# Altium project front_controller.PrjPcb
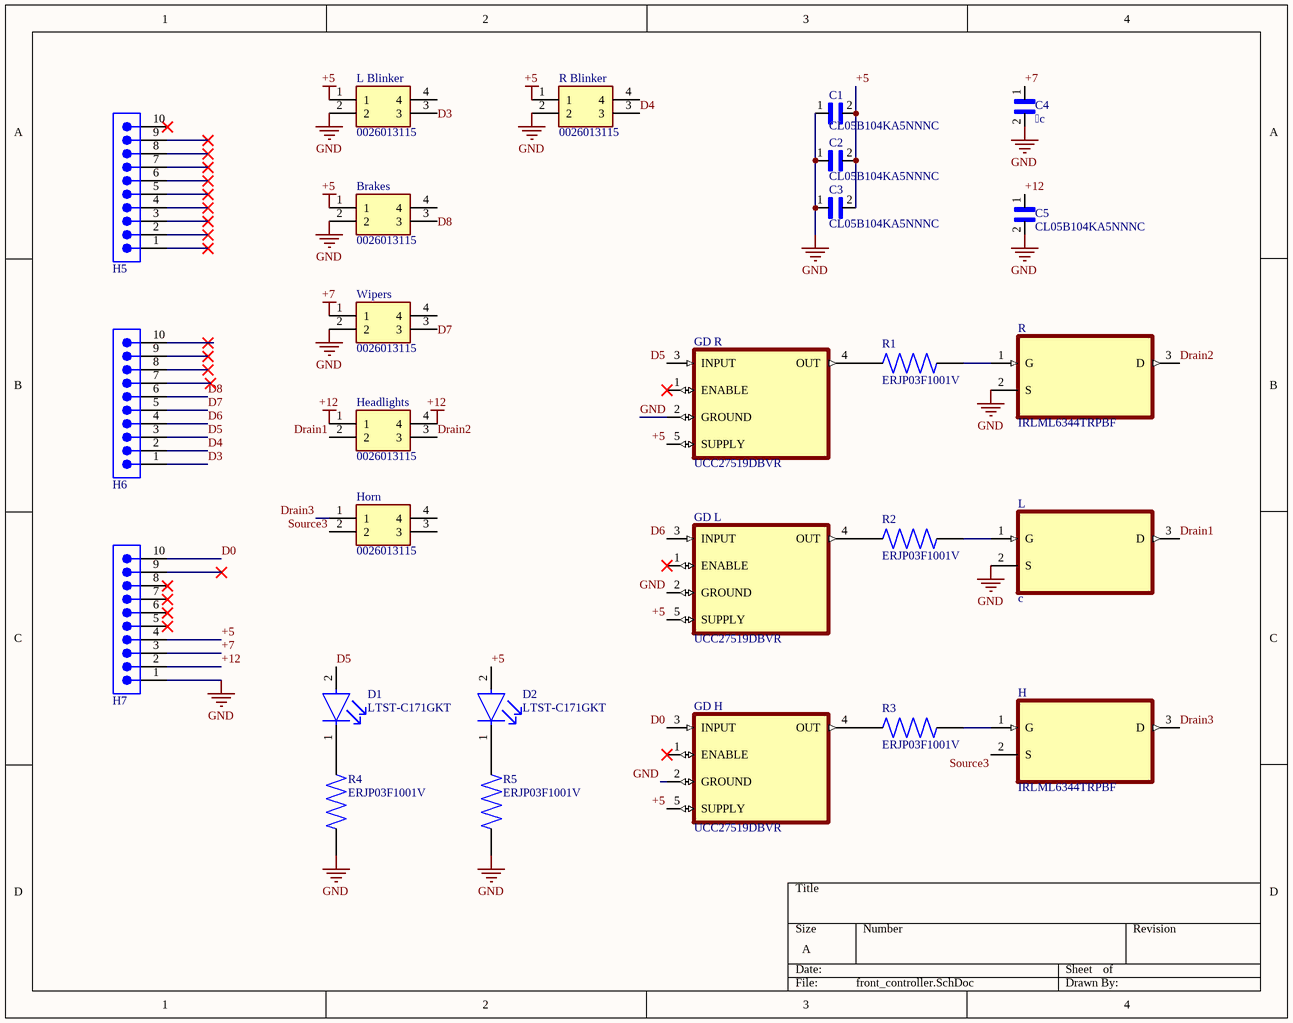
[diagram p0: front_controller.SchDoc]
1 sheet, 27 parts. Net scope: global (net labels, ports and power ports of the same name join across sheets).
Board files: front_controller.PcbDoc, front_controller - Copy.PcbDoc

## Sheet front_controller.SchDoc
size A; SheetNumber: 1; SheetTotal: 1

### Parts
Brakes  0026013115  [MOLEX_0026013115]
C1  CL05B104KA5NNNC  [CAPC1005X55N]
C2  CL05B104KA5NNNC  [CAPC1005X55N]
C3  CL05B104KA5NNNC  [CAPC1005X55N]
C4  c  [CAPC1005X55N]
C5  CL05B104KA5NNNC  [CAPC1005X55N]
D1  LTST-C171GKT  [FP-LTST-C171GKT-MFG]
D2  LTST-C171GKT  [FP-LTST-C171GKT-MFG]
GD_H  UCC27519DBVR  [SOT95P280X145-5N]
GD_L  UCC27519DBVR  [SOT95P280X145-5N]
GD_R  UCC27519DBVR  [SOT95P280X145-5N]
H  IRLML6344TRPBF  [SOT95P240X112-3N]
H5  61301011121  [61301011121]  (value not drawn)
H6  61301011121  [61301011121]  (value not drawn)
H7  61301011121  [61301011121]  (value not drawn)
Headlights  0026013115  [MOLEX_0026013115]
Horn  0026013115  [MOLEX_0026013115]
L  c  [SOT95P240X112-3N]
L_Blinker  0026013115  [MOLEX_0026013115]
R  IRLML6344TRPBF  [SOT95P240X112-3N]
R1  ERJP03F1001V  [RES_ERJP03F1001V]
R2  ERJP03F1001V  [RES_ERJP03F1001V]
R3  ERJP03F1001V  [RES_ERJP03F1001V]
R4  ERJP03F1001V  [RES_ERJP03F1001V]
R5  ERJP03F1001V  [RES_ERJP03F1001V]
R_Blinker  0026013115  [MOLEX_0026013115]
Wipers  0026013115  [MOLEX_0026013115]

### Nets
+5: Brakes.1 C1.2 C2.2 C3.2 D2.2(A) GD_H.5(SUPPLY) GD_L.5(SUPPLY) GD_R.5(SUPPLY) H7.4 L_Blinker.1 R_Blinker.1
+7: C4.1 H7.3 Wipers.1
+12: C5.1 H7.2 Headlights.1 Headlights.4
GND: Brakes.2 C1.1 C2.1 C3.1 C4.2 C5.2 GD_H.2(GROUND) GD_L.2(GROUND) GD_R.2(GROUND) H7.1 L.2(S) L_Blinker.2 R.2(S) R4.1 R5.1 R_Blinker.2 Wipers.2
D0: GD_H.3(INPUT) H7.10
D3: H6.1 L_Blinker.3
D4: H6.2 R_Blinker.3
D5: D1.2(A) GD_R.3(INPUT) H6.3
D6: GD_L.3(INPUT) H6.4
D7: H6.5 Wipers.3
D8: Brakes.3 H6.6
Drain1: Headlights.2 L.3(D)
Drain2: Headlights.3 R.3(D)
Drain3: H.3(D) Horn.1
Source3: H.2(S) Horn.2
NetD1_1: D1.1(C) R4.2
NetD2_1: D2.1(C) R5.2
NetGD_H_4: GD_H.4(OUT) R3.1
NetGD_L_4: GD_L.4(OUT) R2.1
NetGD_R_4: GD_R.4(OUT) R1.1
NetH_1: H.1(G) R3.2
NetL_1: L.1(G) R2.2
NetR_1: R.1(G) R1.2

Not connected (* = marked no-connect by the designer): Brakes 4; GD_H 1(ENABLE)*; GD_L 1(ENABLE)*; GD_R 1(ENABLE)*; H5 1* 2* 3* 4* 5* 6* 7* 8* 9* 10*; H6 7* 8* 9* 10*; H7 5* 6* 7* 8* 9*; Horn 3 4; L_Blinker 4; R_Blinker 4; Wipers 4

### Library data of the parts
Brakes Headlights Horn L_Blinker R_Blinker Wipers = 0026013115: Connector Header Through Hole, Right Angle 4 position 0.165 (4.20mm); MF: Molex; Package: None; MP: 0026013115; DigiKey-Purchase-URL: https://snapeda.com/shop?store=DigiKey&id=2597941; Value: *; SnapEDA_Link: https://www.snapeda.com/parts/0026013115/Molex/view-part/2597941/?ref=snap; Price: None; Availability: Unavailable
C1-C5 = CL05B104KA5NNNC: 0.1ÂµF Â±10% 25V Ceramic Capacitor X7R 0402 (1005 Metric); MF: Samsung Electro-Mechanics; SnapEDA_Link: https://www.snapeda.com/parts/CL05B104KA5NNNC/Samsung%20Electro-Mechanics/view-part/1365388/?ref=snap; MP: CL05B104KA5NNNC; DigiKey-Purchase-URL: https://snapeda.com/shop?store=DigiKey&id=1365388; Value: *; Digi-Key_Part_Number: 1276-6720-1-ND; Package: 0402 Samsung
D1 D2 = CMP-22017-000007-1: LED GREEN CLEAR CHIP SMD; Luminous Intensity: 12mcd; Lens Color: Colorless; Dominant Wavelength: 569nm; Number of LEDs: 1; Power Dissipation: 100mW; Viewing Angle: 130°; Reverse Voltage: 5V; Test Current: 10mA; Forward Voltage: 2.1V; Wavelength: 585nm; Lens Style: Diffused; Forward Current: 30mA; Height: 0.8mm; Mount: Surface Mount; Package Quantity: 1; Length: 2mm; Case Code (Metric): 2012; Number of Pins: 2; Number of Elements: 1; Packaging: Tape and Reel; Color: Green; Min Operating Temperature: -55°C; Case/Package: 0805; Power Rating: 100mW; Max Operating Temperature: 85°C; Radiation Hardening: No; Depth: 1.25mm; Lens Transparency: Clear; Width: 1.25mm; Lead Free: Lead Free; Case Code (Imperial): 0805; Illumination Color: Green
H L R = IRLML6344TRPBF: N-Channel 30V 5A _Ta_ 1.3W _Ta_ Surface Mount Micro3â„¢/SOT-23; MF: Infineon Technologies; Package: SOT-23 Infineon; Value: *; Price: None; MP: IRLML6344TRPBF; Availability: Unavailable; SnapEDA_Link: https://www.snapeda.com/parts/IRLML6344TRPBF/Infineon%20Technologies/view-part/1786730/?ref=snap
H5-H7 = 61301011121: WR-PHD Pin Header, THT, Vertical, pitch 2.54mm, 1 Row, 10P; Manufacturer: Wurth Elektronik; Contact Resistance: 20mOhm; Rated Current: 3A; Working Voltage: 250V; Withstanding Voltage: 500V; Manufacturer Part Number: 61301011121; Category: Board-to-Board Connectors; Match Code: WR-PHD; ComponentLink1Description: Website Link; ComponentLink1URL: https://www.we-online.com/redexpert/article/61301011121?ad; ComponentLink2Description: Datasheet Link; ComponentLink2URL: https://www.we-online.com/redexpert/spec/61301011121?ad; Mount: Through Hole; Operating Temperature Max: 105°C; Operating Temperature Min: -40°C; Packaging: Bag; Gender: Pin Header; Number of Pins: 10; Number of Rows: 1; Orientation: Vertical; Pitch: 2.54mm
GD_H GD_L GD_R = UCC27519DBVR: Package: None; Price: None; Value: *; MP: UCC27519DBVR; Availability: Unavailable
R1-R5 = ERJP03F1001V: Value: *; Availability: Unavailable; Package: None; Price: None; MP: ERJP03F1001V